# Altium schematic sheet SCH-5.SchDoc
size A4; Date: 05.05.2020; Organization: Günsel Model 1 Body Harness; Revision: v0.1
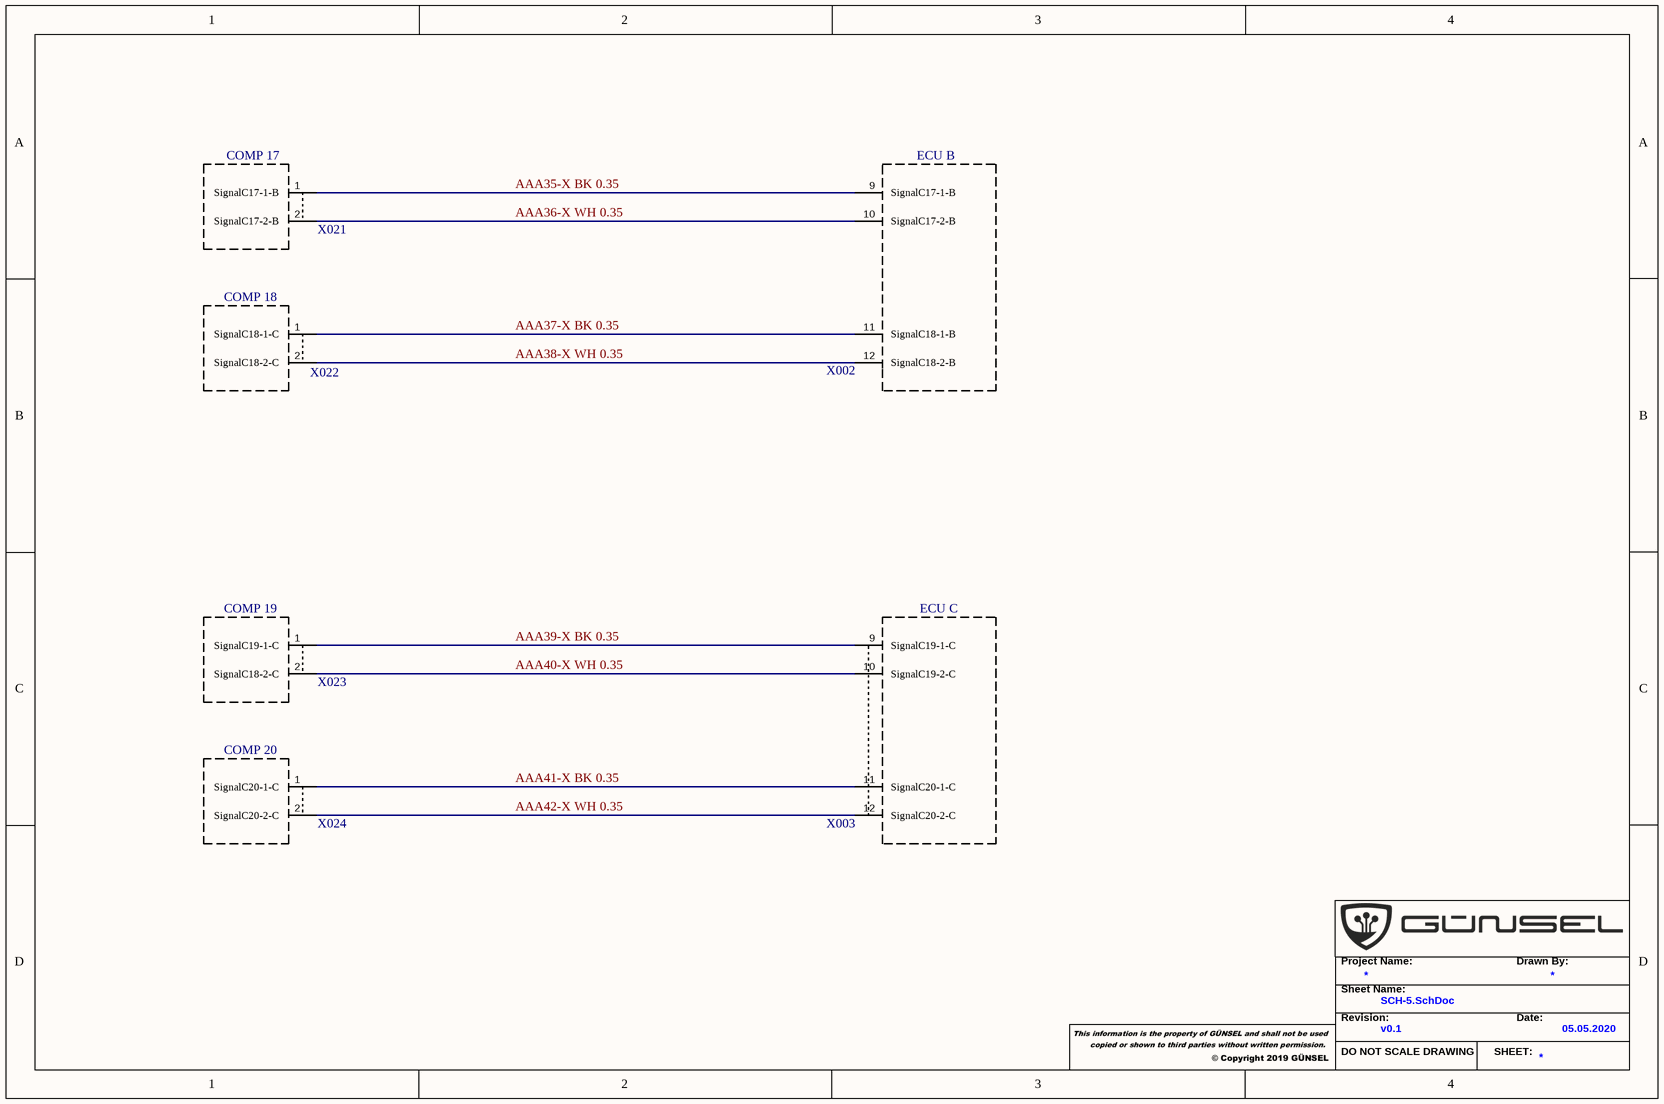
[diagram p0: SCH-5.SchDoc]

## Parts
X25  X002
X26  X021
X27  X022
X28  X003
X29  X023
X30  X024

## Blocks framed on the sheet
COMP 18: X27
COMP 19: X29
ECU C: X28

## Nets
AAA35-X BK 0.35: X25.9(SignalC17-1-B) X26.1(SignalC17-1-B)
AAA36-X WH 0.35: X25.10(SignalC17-2-B) X26.2(SignalC17-2-B)
AAA37-X BK 0.35: X25.11(SignalC18-1-B) X27.1(SignalC18-1-C)
AAA38-X WH 0.35: X25.12(SignalC18-2-B) X27.2(SignalC18-2-C)
AAA39-X BK 0.35: X28.9(SignalC19-1-C) X29.1(SignalC19-1-C)
AAA40-X WH 0.35: X28.10(SignalC19-2-C) X29.2(SignalC18-2-C)
AAA41-X BK 0.35: X28.11(SignalC20-1-C) X30.1(SignalC20-1-C)
AAA42-X WH 0.35: X28.12(SignalC20-2-C) X30.2(SignalC20-2-C)

Not connected (* = marked no-connect by the designer): X25 1 2 3 4 5 6 7 8 13 14 15 16 17 18 19 20; X26 3 4 5; X27 3 4 5; X28 1 2 3 4 5 6 7 8(SignalC10-2-C) 13 14 15 16 17 18 19 20; X29 3 4 5; X30 3 4 5

## Notes on the sheet
- (near X26) COMP 17
- (near X25) ECU B
- (near X30) COMP 20
- Project Name:
- Drawn By:
- Sheet Name:
- Revision:
- DO NOT SCALE DRAWING
- SHEET:
- Date:

## Library data of the parts
X25 = ECU B: Designator_: X002; Pin count: 20; Manufacturer Part number: E-2
X26 = COMP 17: Designator_: X021; Pin count: 5; Manufacturer Part number: C-17
X27 = COMP 18: Designator_: X022; Pin count: 5; Manufacturer Part number: C-18
X28 = ECU C: Designator_: X003; Pin count: 20; Manufacturer Part number: E-3
X29 = COMP 19: Designator_: X023; Pin count: 5; Manufacturer Part number: C-19
X30 = COMP 20: Designator_: X024; Pin count: 5; Manufacturer Part number: C-20